# EAGLE schematic Pure LFO (EAGLE 7.6.0)
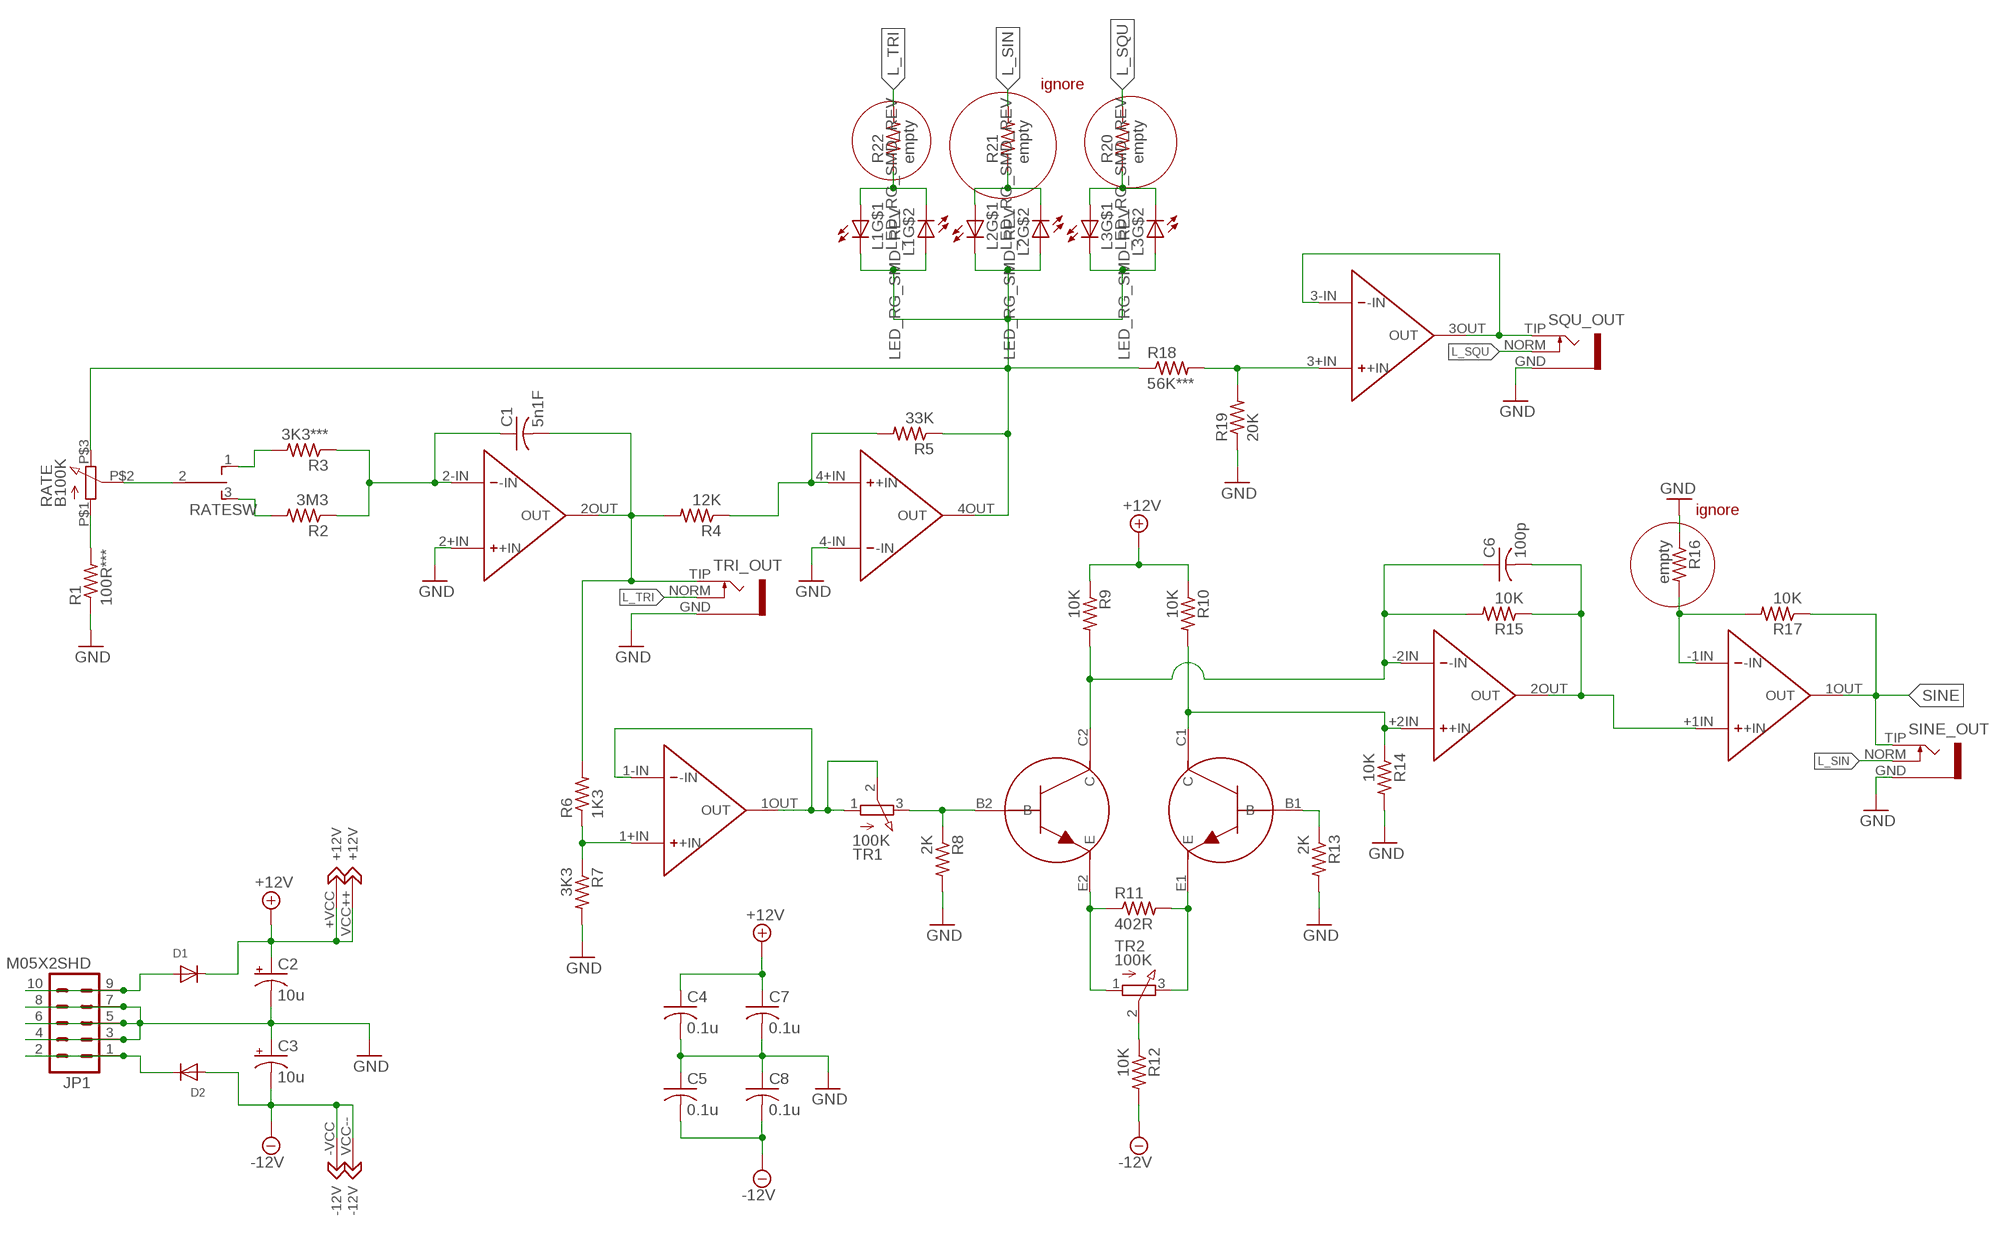
[diagram p0: schematic, sheet 1]

## Parts
C1  5n1F  C-USC0805K  [C0805K]
C2  10u  CPOL-US153CLV-0505  [153CLV-0505]
C3  10u  CPOL-US153CLV-0505  [153CLV-0505]
C4  0.1u  C-USC0805K  [C0805K]
C5  0.1u  C-USC0805K  [C0805K]
C6  100p  C-USC0805K  [C0805K]
C7  0.1u  C-USC0805K  [C0805K]
C8  0.1u  C-USC0805K  [C0805K]
D1  DIODESMA  [SMADIODE]
D2  DIODESMA  [SMADIODE]
JP1  M05X2SHD  [2X5-SHROUDED]
L1  LED_RG_SMD_REV  [LSG_T77K]
L2  LED_RG_SMD_REV  [LSG_T77K]
L3  LED_RG_SMD_REV  [LSG_T77K]
R1  100R***  R-US_R0805  [R0805]
R2  3M3  R-US_R0805  [R0805]
R3  3K3***  R-US_R0805  [R0805]
R4  12K  R-US_R0805  [R0805]
R5  33K  R-US_R0805  [R0805]
R6  1K3  R-US_R0805  [R0805]
R7  3K3  R-US_R0805  [R0805]
R8  2K  R-US_R0805  [R0805]
R9  10K  R-US_R0805  [R0805]
R10  10K  R-US_R0805  [R0805]
R11  402R  R-US_R0805  [R0805]
R12  10K  R-US_R0805  [R0805]
R13  2K  R-US_R0805  [R0805]
R14  10K  R-US_R0805  [R0805]
R15  10K  R-US_R0805  [R0805]
R16  empty  R-US_R0805  [R0805]
R17  10K  R-US_R0805  [R0805]
R18  56K***  R-US_R0805  [R0805]
R19  20K  R-US_R0805  [R0805]
R20  empty  R-US_R0805  [R0805]
R21  empty  R-US_R0805  [R0805]
R22  empty  R-US_R0805  [R0805]
RATE  B100K  Q-POT  [Q-POT]
RATESW  TOGGLE_ON_OFF_ON  [TOGGLE_ON_OFF_ON]
SINE_OUT  S_JACK  [S_JACK]
SQU_OUT  S_JACK  [S_JACK]
T3  TRANS_PAIR  [TRANS_PAIR]
TR1  100K  TRIM_3269W  [TRIM_3269W]
TR2  100K  TRIM_3269W  [TRIM_3269W]
TRI_OUT  S_JACK  [S_JACK]
U1  DUAL_OPAMP  [DUAL_OPAMP]
U2  QUAD_OPAMP  [QUAD_OPAMP]

## Nets
+12V: C2.+ C4.1 C7.1 D1.C R9.1 R10.1 U1.+VCC(+12V) U2.VCC++(+12V)
-12V: C3.- C5.2 C8.2 D2.A R12.2 U1.-VCC(-12V) U2.VCC--(-12V)
GND: C2.- C3.+ C4.2 C5.1 C7.2 C8.1 JP1.3 JP1.4 JP1.5 JP1.6 JP1.7 JP1.8 R1.1 R7.2 R8.2 R13.2 R14.2 R16.1 R19.1 SINE_OUT.GND SQU_OUT.GND TRI_OUT.GND U2.2+IN(+IN) U2.4-IN(-IN)
L_SIN: R21.2 SINE_OUT.NORM
L_SQU: R20.2 SQU_OUT.NORM
L_TRI: R22.2 TRI_OUT.NORM
N$1: R1.2 RATE.P$1
N$2: RATE.P$2 RATESW.2(P)
N$3: R3.2 RATESW.1(O)
N$4: R2.2 RATESW.3(S)
N$5: R18.2 R19.2 U2.3+IN(+IN)
N$6: C1.1 R2.1 R3.1 U2.2-IN(-IN)
N$7: C1.2 R4.2 R6.2 TRI_OUT.TIP U2.2OUT(OUT)
N$8: SQU_OUT.TIP U2.3-IN(-IN) U2.3OUT(OUT)
N$9: R4.1 R5.2 U2.4+IN(+IN)
N$11: D1.A JP1.9 JP1.10
N$13: L1.1(C) L1.4(A) L2.1(C) L2.4(A) L3.1(C) L3.4(A) R5.1 R18.1 RATE.P$3 U2.4OUT(OUT)
N$15: L1.2(A) L1.3(C) R22.1
N$16: L2.2(A) L2.3(C) R21.1
N$17: L3.2(A) L3.3(C) R20.1
N$21: R11.1 T3.E2(E) TR2.1
N$25: R8.1 T3.B2(B) TR1.3
N$26: R11.2 T3.E1(E) TR2.3
N$27: R12.1 TR2.2
N$28: R13.1 T3.B1(B)
N$32: C6.1 R9.2 R15.2 T3.C2(C) U1.-2IN(-IN)
N$33: TR1.1 TR1.2 U2.1-IN(-IN) U2.1OUT(OUT)
N$34: R10.2 R14.1 T3.C1(C) U1.+2IN(+IN)
N$35: R6.1 R7.1 U2.1+IN(+IN)
N$38: R16.2 R17.2 U1.-1IN(-IN)
N$50: D2.C JP1.1 JP1.2
SINE: R17.1 SINE_OUT.TIP U1.1OUT(OUT)
SINE_PRE: C6.2 R15.1 U1.2OUT(OUT) U1.+1IN(+IN)

## Notes on the sheet
- ignore
- ignore

## Library data of the parts
C1 C4-C8 = rcl:C-US: CAPACITOR, American symbol
C2 C3 = rcl:CPOL-US: POLARIZED CAPACITOR, American symbol
D1 D2 = adafruit:DIODE: Diode SMADIODE - SMA Surface Mount Package 20V 1A Schottky Diode Digikey: 641-1014-6-ND DO-1N4148 - Through Hole Small Current Diode SOD-123 20V 1 A (.5mV Vf) Schottky Diode - Digikey: MBRX120TPMSCT-ND SOD-323 10V 570mA (.38mV Vf, 3ns) Schottky Diode - Digikey: ZLLS410CT-ND SOD-523 30V 30mA Schottky Diode (RB751S-40TE61) - Digikey: RB751S-40TE61CT-ND SOT23-R/W - SOT23 Package (R = Solder Paste/Reflow Ovens, W = Hand-Soldering) BAT54Film 40V 300mA - Digikey: 497-7162-1-ND
JP1 = SparkFun-Connectors:M05X2: Header 5x2 Standard 10-pin dual row 0.1" header. Commonly used with AVR-ISP. Use with Spark Fun Electronics SKU: PRT-00778
L1-L3 = INSTRUO:LED_RG_SMD_REV: http://uk.rs-online.com/web/p/visible-leds/7193196/
R1-R22 = rcl:R-US_: RESISTOR, American symbol
RATE = INSTRUO:Q-POT
RATESW = INSTRUO:TOGGLE_ON_OFF_ON
SINE_OUT SQU_OUT TRI_OUT = INSTRUO:S_JACK
T3 = QuBit:TRANS_PAIR
TR1 TR2 = INSTRUO:TRIM_3269W: Manufacturer Part #: 3269W-1-101GLF
U1 = INSTRUO:DUAL_OPAMP
U2 = INSTRUO:QUAD_OPAMP